# EasyEDA Pro project 工创赛底盘主控v3_2025-03-24.epro, board PCB1
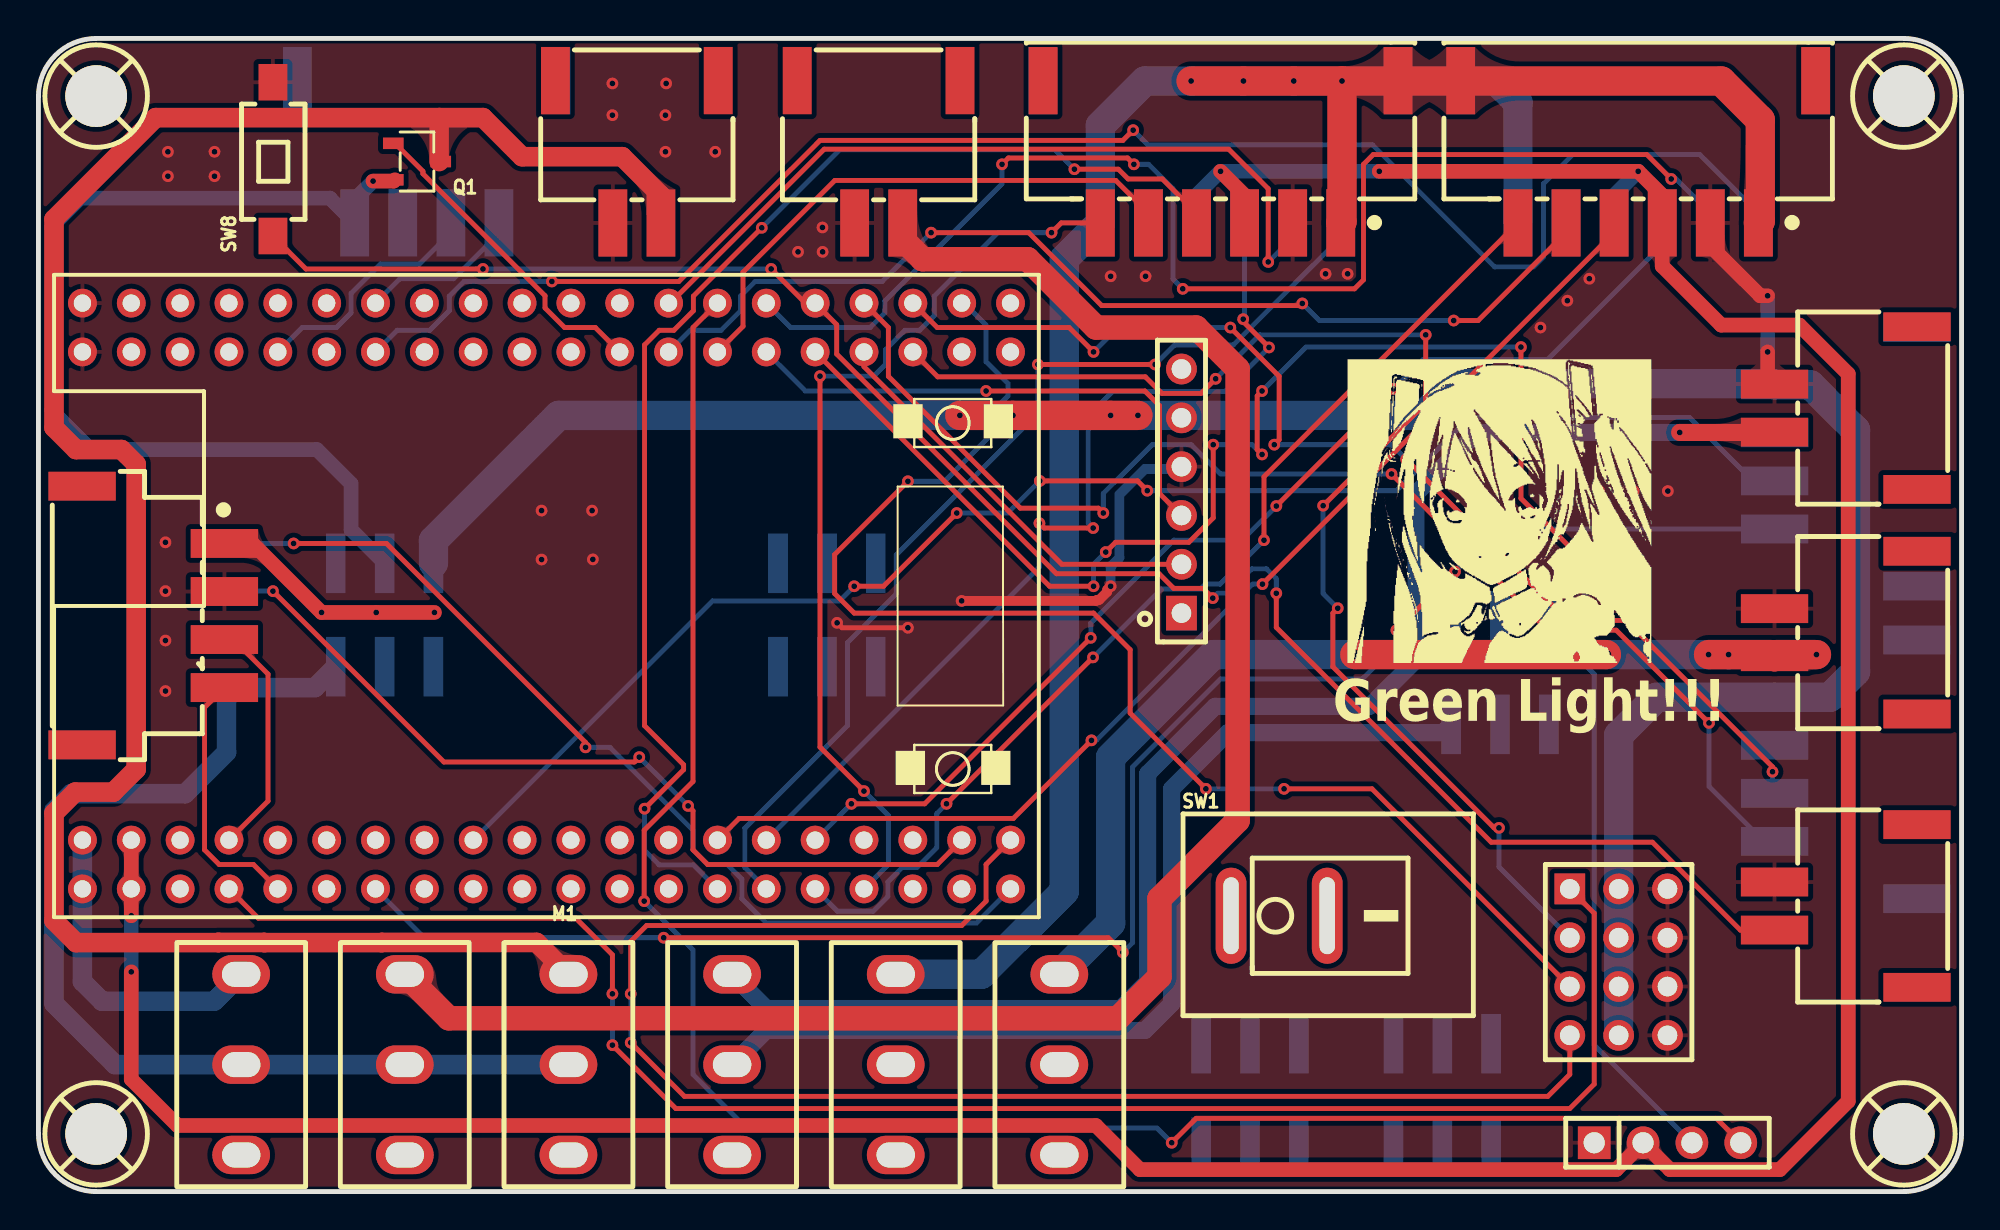
[diagram p7: board, top side]
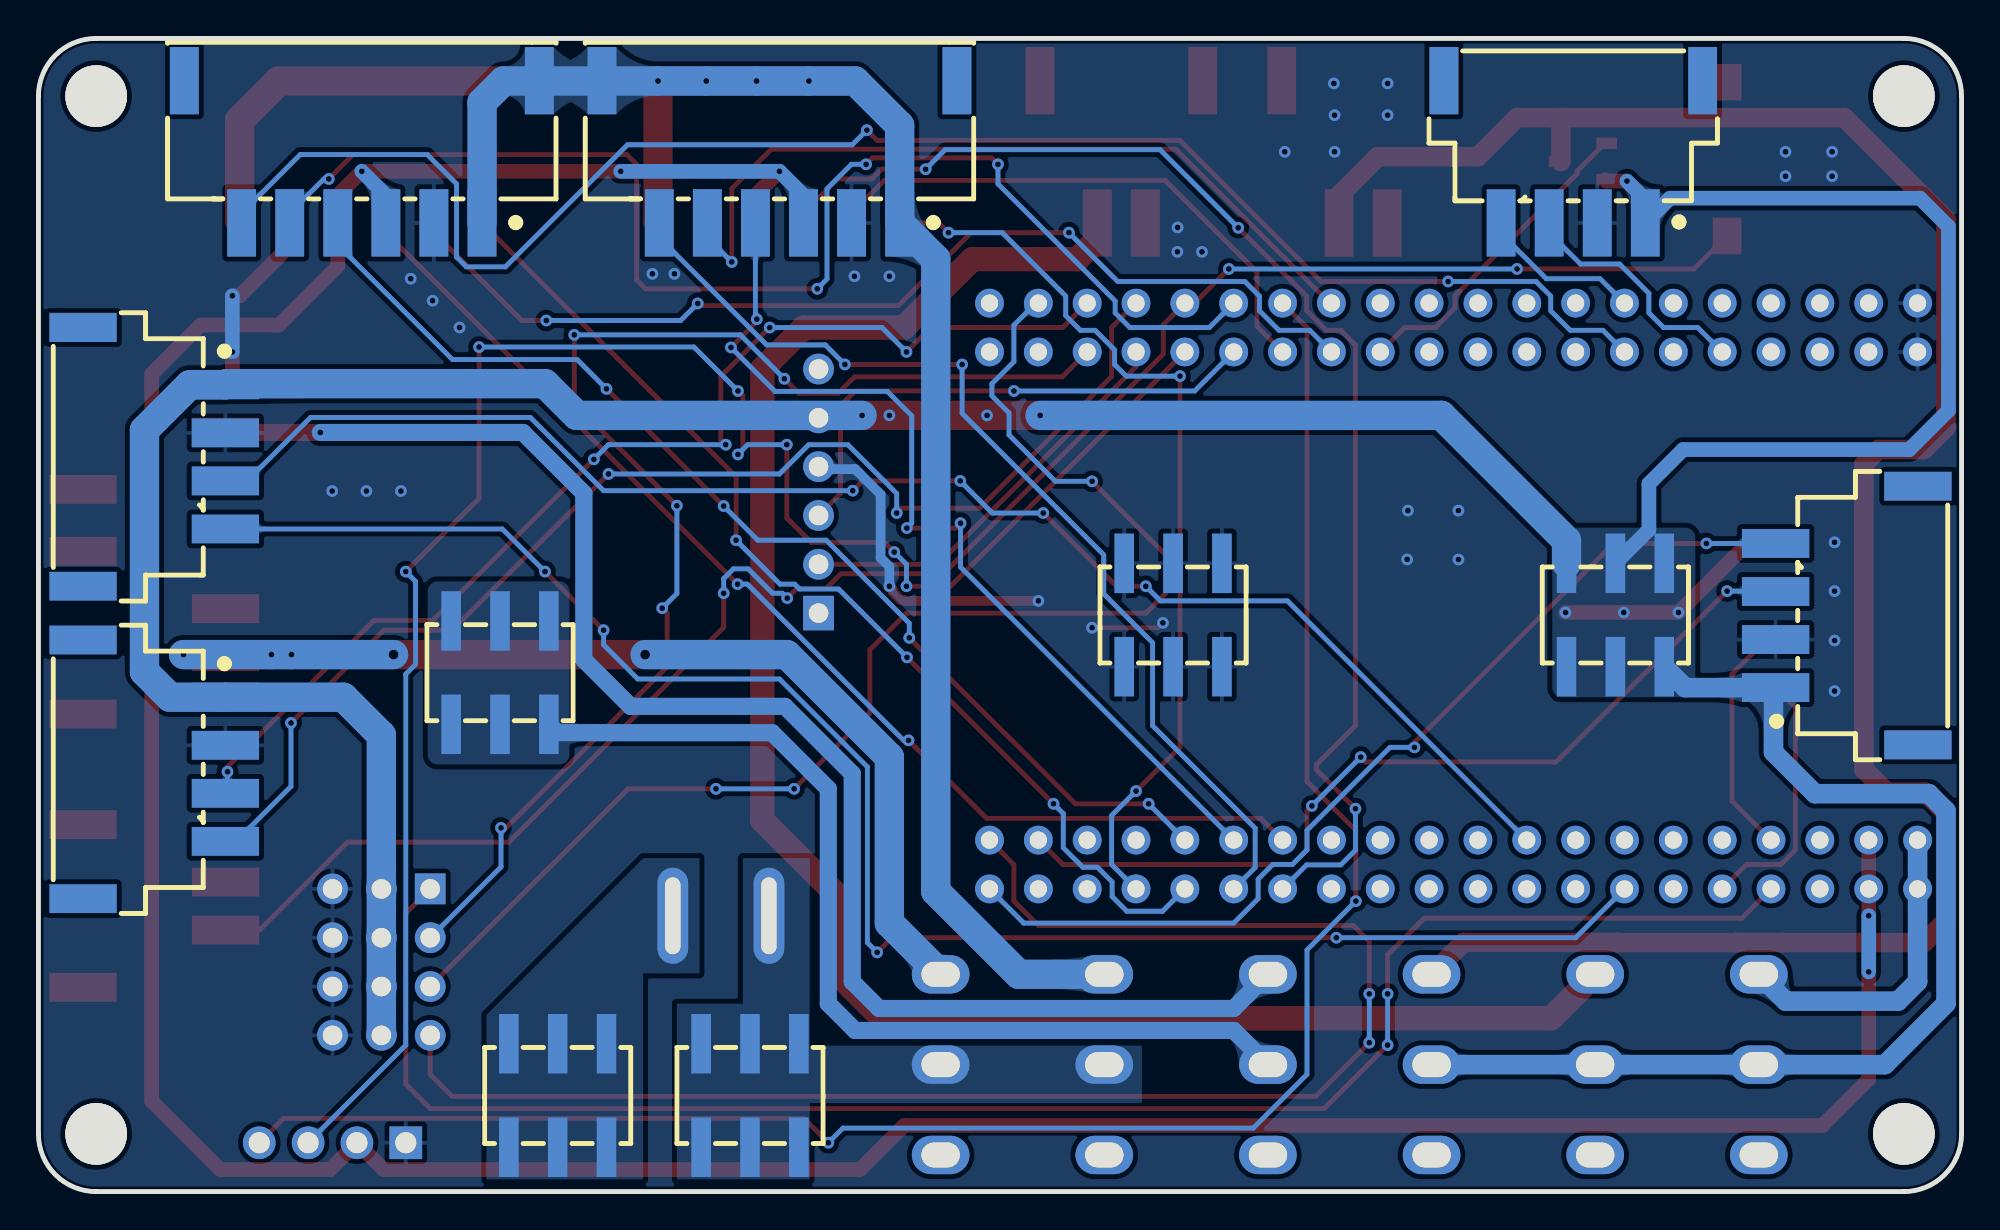
[diagram p8: board, bottom side, seen from below]

Outline 100 x 60 mm; copper layers: Top Layer, Bottom Layer. Coordinates in mm from the lower left corner of the outline.
Outline path: 0,57 0,3 arc(0,2.99) 0,2.97 arc(0.89,0.87) 3,0 97,0 arc(99.12,0.88) 100,3 100,57 arc(99.12,59.12) 97,60 3,60 arc(0.88,59.12) 0,57
Stack: Top Layer 0.035mm / Dielectric1 1.51mm FR4 er 4.5 / Bottom Layer 0.035mm

## Design rules (mm)
template: 自定义配置
spacing copperThickness1oz (default): track to track 0.203, other pairs 0.152 to 0.3
spacing copperThickness2oz: track to track 0.203, other pairs 0.152 to 0.3
track width copperThickness1oz (default): min 0.254, default 0.254, max 2.54
track width copperThickness2oz: min 0.203, default 0.254, max 2.54
differential pair differentialPair (default): width min 0.127, default 0.254, max 2.54; gap min 0.152, default 0.152
via viaSize (default): diameter min 0.5, default 0.61, max 10; hole min 0.3, default 0.305, max 6.299

## Placement (name value [footprint] x y rotation side)
CN1  WAFER-254W-6P  [CONN-SMD_WAFER-254W-6P]  61.47 54.1 180 top
CN2  WAFER-254W-6P  [CONN-SMD_WAFER-254W-6P]  83.19 54.1 180 top
CN3  WAFER-254W-6P  [CONN-SMD_WAFER-254W-6P]  61.47 54.1 0 bottom
CN4  WAFER-254W-6P  [CONN-SMD_WAFER-254W-6P]  83.19 54.1 0 bottom
CN6  WAFER-254W-2P  [CONN-SMD_2P-L10.0-W7.8-P2.5]  31.12 54.1 180 top
CN7  WAFER-254W-2P  [CONN-SMD_2P-L10.0-W7.8-P2.5]  93.98 40.77 90 top
CN8  WAFER-254W-2P  [CONN-SMD_2P-L10.0-W7.8-P2.5]  43.69 54.1 180 top
CN9  WAFER-254W-2P  [CONN-SMD_2P-L10.0-W7.8-P2.5]  93.98 29.08 90 top
CN10  WAFER-254W-2P  [CONN-SMD_2P-L10.0-W7.8-P2.5]  93.98 14.86 90 top
H2  PZ254-2-03-S  [HDR-SMD_6P-P2.54-V-M-R2-C3-LS7.5-2]  76 27 180 bottom
H3  PZ254-2-03-S  [HDR-SMD_6P-P2.54-V-M-R2-C3-LS7.5-2]  18 30 180 bottom
H4  PZ254-2-03-S  [HDR-SMD_6P-P2.54-V-M-R2-C3-LS7.5-2]  41 30 180 bottom
H5  PZ254-2-03-S  [HDR-SMD_6P-P2.54-V-M-R2-C3-LS7.5-2]  73 5 180 bottom
H6  PZ254-2-03-S  [HDR-SMD_6P-P2.54-V-M-R2-C3-LS7.5-2]  63 5 180 bottom
H7  2.54-1*4P母  [HDR-TH_4P-P2.54-V-F]  84.71 2.54 0 top
M1  -  [FK407M1]  2.29 18.29 180 top
Q1  AO3407  [SOT-23-3_L2.9-W1.6-P1.90-LS2.8-BR]  19.69 53.59 180 top
SCREW1  -  [M3螺丝]  3 57 0 top
SCREW2  -  [M3螺丝]  97 57 0 top
SCREW3  -  [M3螺丝]  3 3 0 top
SCREW4  -  [M3螺丝]  97 3 0 top
SW1  KCD11-2P-R  [SW-TH_2P-L15.0-W10.5-P5.00_KCD11-2P-R]  64.52 14.35 0 top
SW2  SS-12D10L5  [SW-TH_SS-12D10L5]  27.56 6.6 270 top
SW3  SS-12D10L5  [SW-TH_SS-12D10L5]  36.07 6.6 270 top
SW4  SS-12D10L5  [SW-TH_SS-12D10L5]  10.54 6.6 270 top
SW5  SS-12D10L5  [SW-TH_SS-12D10L5]  44.58 6.6 270 top
SW6  SS-12D10L5  [SW-TH_SS-12D10L5]  53.09 6.6 270 top
SW7  SS-12D10L5  [SW-TH_SS-12D10L5]  19.05 6.6 270 top
SW8  TS-1101-C-W  [SW-SMD_L6.0-W3.3-LS8.0]  12.19 53.72 90 top
U1  WAFER-254W-4P  [CONN-SMD_4P-P2.50-WAFER-254W-4P]  5.97 29.97 270 top
U4  KH-2.54PH180-3X4P-L11.5  [HDR-TH-12P-P2.54-V-M-R3-C4-S5.08]  82.17 11.94 270 top
U5  PM2.54-1*6  [HDR-TH_6P-P2.54-V-F]  59.44 36.45 90 top
U6  WAFER-254W-4P  [CONN-SMD_4P-P2.50-WAFER-254W-4P]  20.19 54.1 0 bottom
U7  WAFER-254W-4P  [CONN-SMD_4P-P2.50-WAFER-254W-4P]  93.98 21.97 270 bottom
U8  WAFER-254W-4P  [CONN-SMD_4P-P2.50-WAFER-254W-4P]  93.98 38.23 270 bottom
U9  WAFER-254W-4P  [CONN-SMD_4P-P2.50-WAFER-254W-4P]  5.97 29.97 90 bottom

## Footprints (pads in the part's own frame, mm; a bottom-side part is the same pattern mirrored in y, then rotated)
CONN-SMD_2P-L10.0-W7.8-P2.5
  rect 1.5x3.5 smd: 1(-1.253,3.704) 2(1.248,3.704) 3(4.232,-3.704) 4(-4.232,-3.704)
CONN-SMD_4P-P2.50-WAFER-254W-4P
  rect 1.5x3.5 smd: 1(-3.75,3.7) 2(-1.25,3.7) 3(1.25,3.7) 4(3.75,3.7) 5(-6.73,-3.7) 6(6.73,-3.7)
CONN-SMD_WAFER-254W-6P
  rect 1.5x3.5 smd: 1(-6.25,3.7) 2(-3.75,3.7) 3(-1.25,3.7) 4(1.25,3.7) 5(3.75,3.7) 6(6.25,3.7) 7(-9.23,-3.7) 8(9.23,-3.7)
FK407M1
  round 1.5 hole 0.9: 1(0,-25.4) 2(0,-27.94) 3(-2.54,-25.4) 4(-2.54,-27.94) 5(-5.08,-25.4) 6(-5.08,-27.94) 7(-7.62,-25.4) 8(-7.62,-27.94) 9(-10.16,-25.4) 10(-10.16,-27.94) 11(-12.7,-25.4) 12(-12.7,-27.94) 13(-15.24,-25.4) 14(-15.24,-27.94) 15(-17.78,-25.4) 16(-17.78,-27.94) 17(-20.32,-25.4) 18(-20.32,-27.94) 19(-22.86,-25.4) 20(-22.86,-27.94) 21(-25.4,-25.4) 22(-25.4,-27.94) 23(-27.94,-25.4) 24(-27.94,-27.94) 25(-30.48,-25.4) 26(-30.48,-27.94) 27(-33.02,-25.4) 28(-33.02,-27.94) 29(-35.56,-25.4) 30(-35.56,-27.94) 31(-38.1,-25.4) 32(-38.1,-27.94) 33(-40.64,-25.4) 34(-40.64,-27.94) 35(-43.18,-25.4) 36(-43.18,-27.94) 37(-45.72,-25.4) 38(-45.72,-27.94) 39(-48.26,-25.4) 40(-48.26,-27.94) 41(0,2.54) 42(0,0) 43(-2.54,2.54) 44(-2.54,0) 45(-5.08,2.54) 46(-5.08,0) 47(-7.62,2.54) 48(-7.62,0) 49(-10.16,2.54) 50(-10.16,0) 51(-12.7,2.54) 52(-12.7,0) 53(-15.24,2.54) 54(-15.24,0) 55(-17.78,2.54) 56(-17.78,0) 57(-20.32,2.54) 58(-20.32,0) 59(-22.86,2.54) 60(-22.86,0) 61(-25.4,2.54) 62(-25.4,0) 63(-27.94,2.54) 64(-27.94,0) 65(-30.48,2.54) 66(-30.48,0) 67(-33.02,2.54) 68(-33.02,0) 69(-35.56,2.54) 70(-35.56,0) 71(-38.1,2.54) 72(-38.1,0) 73(-40.64,2.54) 74(-40.64,0) 75(-43.18,2.54) 76(-43.18,0) 77(-45.72,2.54) 78(-45.72,0) 79(-48.26,2.54) 80(-48.26,0)
HDR-SMD_6P-P2.54-V-M-R2-C3-LS7.5-2
  rect 1.02x3.1 smd: 1(-2.54,-2.69) 2(-2.54,2.69) 3(0,-2.69) 4(0,2.69) 5(2.54,-2.69) 6(2.54,2.69)
HDR-TH-12P-P2.54-V-M-R3-C4-S5.08
  rect 1.6x1.6 hole 1.02: 1(-3.81,-2.54)
  round 1.6 hole 1.02: 2(-3.81,0) 3(-3.81,2.54) 4(-1.27,-2.54) 5(-1.27,0) 6(-1.27,2.54) 7(1.27,-2.54) 8(1.27,0) 9(1.27,2.54) 10(3.81,-2.54) 11(3.81,0) 12(3.81,2.54)
HDR-TH_4P-P2.54-V-F
  rect 1.7x1.7 hole 1.1: 1(-3.81,0)
  round 1.7 hole 1.1: 2(-1.27,0) 3(1.27,0) 4(3.81,0)
HDR-TH_6P-P2.54-V-F
  rect 1.8x1.6 hole 1.02: 1(-6.35,0)
  round 1.6 hole 1.02: 2(-3.81,0) 3(-1.27,0) 4(1.27,0) 5(3.81,0) 6(6.35,0)
M3螺丝
  round 3.2 hole 3.2: 1(0,0)
SOT-23-3_L2.9-W1.6-P1.90-LS2.8-BR
  rect 1.07x0.6 smd: 1(1.235,-0.95) 2(1.235,0.95) 3(-1.235,0)
SW-SMD_L6.0-W3.3-LS8.0
  rect 1.9x1.5 smd: 1(-4,0) 2(4,0)
SW-TH_2P-L15.0-W10.5-P5.00_KCD11-2P-R
  oval 1.6x5 hole 0.8x4: 1(-2.5,0) 2(2.5,0)
SW-TH_SS-12D10L5
  oval 2x3 hole 1.3x2: 1(-4.7,0) 2(0,0) 3(4.7,0)

## Nets
As in the schematic.

Pads without a net: CN1 8; CN2 7; CN3 7; CN4 8; CN6 3 4; CN7 3 4; CN8 3 4; CN9 3 4; CN10 3 4; M1 3 4 5 6 7 8 10 11 12 15 16 17 18 19 20 22 24 37 39 40 45 46 50 51 52 54 55 56 61 62 65 66 74 75 76 77; SCREW1 1; SCREW2 1; SCREW3 1; SCREW4 1; SW2 3; SW3 3; SW4 3; SW5 3; SW6 3; SW7 3; U1 5 6; U5 1 6; U6 5 6; U7 5 6; U8 5 6; U9 5 6

## Via types
v1: diameter 0.61, hole 0.305, Top Layer to Bottom Layer, 136 vias
v2: diameter 0.762, hole 0.508, Top Layer to Bottom Layer, 2 vias

## Routing (per net, layer and track width the routed paths; a pad name or vN(x,y) marks a point on that pad's centre or on a via; arc(x,y) is an arc through that point)
3.3V: length 192.9
  Top Layer w0.762: v1(69.72,53.09) v1(83.19,53.09) 84.44,51.84 CN2.3 84.44,48.15 87.5,45.08 91.57,45.08 94.11,42.55 94.11,4.7 90.55,1.14 84.84,1.14 H7.2 82.04,1.14 57.28,1.14 54.98,3.44 7.23,3.44 4.83,5.84 v1(4.83,11.43) ; CN1.3 62.72,51.84 v1(61.47,53.09) ; M1.44 M1.43 v1(4.83,14.35)
  Bottom Layer w0.762: CN3.3 60.22,51.84 v1(61.47,53.09) v1(69.72,53.09) ; CN4.3 81.94,51.84 v1(83.19,53.09) ; v1(4.83,14.35) v1(4.83,11.43)
+24V_RO: length 57
  Top Layer w1.524: v1(86.84,27.94) v1(87.89,27.94) 90.17,27.94 CN9.1 90.39,27.94 v1(92.46,27.94) ; v2(68.45,27.94) v2(81.53,27.94)
  Bottom Layer w1.524: v2(81.53,27.94) v1(86.84,27.94) v1(87.89,27.94) v1(92.46,27.94) ; v2(68.45,27.94) 61.09,27.94 55.75,22.61 55.75,13.97 SW6.1
+24V_WH: length 123.8
  Top Layer w1.524: v1(59.94,57.78) v1(62.66,57.78) v1(65.28,57.78) v1(67.78,57.78) ; CN2.1 89.54,50.5 89.54,55.75 87.5,57.78 v1(67.78,57.78) ; CN1.1 67.78,50.47 v1(67.78,57.78)
  Bottom Layer w1.524: SW5.1 49.02,11.3 53.34,15.62 53.34,48.52 CN3.1 55.22,55.47 57.53,57.78 v1(59.94,57.78) v1(62.66,57.78) v1(65.28,57.78) v1(67.78,57.78) 75.82,57.78 76.94,56.67 CN4.1
GND: length 30.7
  Top Layer w0.254: v1(45.21,29.34) 41.78,29.34 v1(41.53,29.59)
  Top Layer w0.508: v1(55.75,31.5) 55.58,31.32 55.58,31.2 55.16,30.78 55.04,30.78 54.99,30.73 v1(48.01,30.73)
  Top Layer w0.762: CN2.2 86.94,49.21 89.54,46.61 v1(89.92,46.61) ; CN7.2 89.92,42.37 v1(89.92,43.69)
  Bottom Layer w0.508: U5.4 59.31,37.59 57.53,37.59 56.21,36.27 56.21,32.98 55.75,32.52 v1(55.75,31.5)
  Bottom Layer w0.762: v1(89.92,43.69) v1(89.92,46.61)
  vias: v1(6.6,33.78) v1(6.6,31.24) v1(6.6,28.67) v1(6.6,26.04) v1(6.73,54.1) v1(6.73,52.83) v1(9.15,54.1) v1(9.15,52.83) v1(26.16,35.43) v1(26.16,32.89) v1(28.79,35.43) v1(28.83,32.89) v1(29.85,57.66) v1(29.85,56.01) v1(32.64,57.66) v1(32.6,56.01) v1(32.6,54.1) v1(35.19,54.1) v1(39.5,48.89) v1(40.77,50.17) v1(40.78,48.89) v1(55.75,47.62) v1(57.57,47.62) v1(66.93,47.75) v1(68.08,47.75) v1(78.11,44.96) v1(79.5,46.36) v1(80.65,47.5) v1(81.15,36.45) v1(82.95,36.45) v1(84.73,36.45)
VDD_5.0V: length 244
  Top Layer w0.762: v1(17.4,52.58) 18.47,52.58 18.54,52.64 ; v1(20.59,30.13) v1(17.56,30.13) v1(14.72,30.13) 11.13,33.72 U1.1
  Top Layer w1.524: v1(47.91,40.39) v1(50.67,40.39) v1(55.75,40.39) v1(57.17,40.39)
  Bottom Layer w0.762: v1(17.4,52.58) 16.44,51.62 U6.1 15.16,51.69 2.16,51.69 0.68,50.21 0.68,40.64 2.71,38.61 14.48,38.61 16.26,36.83 16.26,34.43 H3.4
  Bottom Layer w1.016: H3.5 14.37,26.22 U9.1 9.78,26.11 9.78,22.86 7.62,20.7 1.7,20.7 0.81,19.81 0.81,9.78 3.98,6.6 SW4.2 SW7.2 SW2.2
  Bottom Layer w1.524: v1(57.17,40.39) 72.01,40.39 73.66,42.04 90.22,42.04 U8.1 92.14,41.98 94.49,39.62 94.49,27.05 93.16,25.72 U7.1 84.14,25.72 82.17,23.75 U4.2 U4.5 U4.8 U4.11 ; H3.2 20.54,33.88 27.05,40.39 v1(47.91,40.39)
VDD_5.0V_IN: length 16.6
  Bottom Layer w1.016: M1.42 M1.41 2.29,10.92 3.3,9.91 9.14,9.91 SW4.1
VDD_19.0V: length 51.3
  Bottom Layer w0.889: H2.5 73.03,23.88 61.85,23.88 58.93,20.95 58.93,9.78 57.53,8.38 37.85,8.38 SW3.2
PA0_U4_TX: length 65.9
  Top Layer w0.254: v1(86.87,24.38) 82.04,29.21 78.49,29.21 v1(70.36,37.34) ; v1(55.37,35.31) 55.12,35.56 51.05,35.56 44.2,42.42 44.2,44.96 M1.34
  Bottom Layer w0.254: U7.4 89.73,18.22 86.87,21.08 v1(86.87,24.38) ; v1(55.37,35.31) 55.37,36.32 57.91,38.86 59.94,38.86 61.47,37.34 v1(70.36,37.34)
PA1_U4_RX: length 59.6
  Top Layer w0.254: v1(71.12,38.1) 79.5,29.72 82.55,29.72 90.17,22.1 v1(90.17,21.84) ; M1.36 46.74,44.96 53.59,44.96 v1(54.86,43.69) ; v1(64.26,38.86) 64.52,39.12 64.52,42.42 v1(61.98,44.96)
  Bottom Layer w0.254: v1(54.86,43.69) 56.13,44.96 v1(61.98,44.96) ; v1(71.12,38.1) 70.36,38.86 v1(64.26,38.86) ; U7.3 90.17,20.83 v1(90.17,21.84)
PA2_U2_TX: length 21.5
  Top Layer w0.254: U5.2 53.21,32.64 42.93,42.93 M1.33
PA3_U2_RX: length 27.8
  Top Layer w0.254: U5.3 58.29,36.32 58.29,40.89 57.53,41.66 v1(49.28,41.66)
  Bottom Layer w0.254: M1.29 39.88,41.66 v1(49.28,41.66)
PA4: length 96.7
  Top Layer w0.254: v1(23.11,48.01) 13.91,48.01 SW8.1 ; CN10.1 88.5,13.61 83.93,18.18 75.54,18.18 64.37,29.35 v1(64.37,31.13) ; v1(38.1,48.01) 39.88,46.23 M1.32 41.51,45.11 41.51,43.58 52.94,32.15 58.27,32.15 59.03,31.39 60.56,31.39 v1(61.07,30.88)
  Bottom Layer w0.254: v1(64.37,31.13) 64.37,31.89 63.86,32.4 63.1,32.4 61.83,31.13 61.32,31.13 v1(61.07,30.88) ; v1(38.1,48.01) v1(23.11,48.01)
PA5: length 68
  Top Layer w0.254: v1(50.11,53.45) 50.44,53.78 56.63,53.78 v1(56.96,53.45) ; v1(59.5,46.97) 68.44,46.97 68.9,47.44 68.9,53.45 69.41,53.96 83.63,53.96 v1(84.9,52.69)
  Bottom Layer w0.254: v1(84.9,52.69) 85.16,52.69 86.94,50.91 CN4.5 ; v1(50.11,53.45) 50.11,52.43 44.01,46.34 44.01,45.72 43.25,44.96 39.12,44.96 M1.30 ; v1(59.5,46.97) 59,47.48 59,52.18 57.73,53.45 v1(56.96,53.45)
PA6: length 29
  Top Layer w0.254: M1.27 36.64,45.02 36.64,47.84 41.41,52.61 56.02,52.61 57.72,50.91 CN1.5
PA7: length 54.1
  Top Layer w0.254: v1(73.59,45.32) 74.86,45.32 79.44,49.89 CN2.5 ; v1(65.72,46.21) 65.61,46.1 55.29,46.1 51.5,49.89 v1(46.42,49.89)
  Bottom Layer w0.254: v1(46.42,49.89) 43.88,47.35 37.27,47.35 36.51,46.59 36.51,45.83 35.49,44.81 33.89,44.81 M1.25 ; v1(65.72,46.21) 66.61,45.32 v1(73.59,45.32)
PA9_U1_TX: length 13.5
  Top Layer w0.254: U1.4 8.64,25.19 8.64,17.78 9.4,17.02 11.18,17.02 M1.49
PA10_U1_RX: length 12.5
  Top Layer w0.254: U1.3 10.14,28.72 11.94,26.92 11.94,20.32 M1.48
PB0: length 41.7
  Top Layer w0.254: v1(63.95,48.37) 63.95,52.18 61.89,54.24 40.86,54.24 32.85,46.23 M1.26
  Bottom Layer w0.254: v1(63.95,48.37) 65.22,49.64 CN3.5
PB10_U3_TX: length 8.5
  Bottom Layer w0.254: M1.14 18.8,47.5 21.59,47.5 23.94,49.85 U6.4
PB11_U3_RX: length 12.7
  Bottom Layer w0.254: M1.9 13.72,44.96 15.49,44.96 16.26,45.72 16.26,46.74 17.78,48.26 19.81,48.26 21.44,49.89 U6.3
PC3: length 97.9
  Top Layer w0.254: v1(63.63,41.66) 63.37,41.4 63.37,38.61 v1(63.63,38.35) ; v1(77.09,43.94) 77.09,36.07 v1(80.9,32.26) ; M1.31 52.58,31.5 v1(54.86,31.5) ; v1(61.09,38.86) 61.09,35.05 59.82,33.78 56.01,33.78 v1(55.5,33.27)
  Bottom Layer w0.254: v1(55.5,33.27) 54.86,32.64 v1(54.86,31.5) ; v1(77.09,43.94) 65.91,43.94 v1(63.63,41.66) ; v1(61.09,38.86) 63.12,38.86 v1(63.63,38.35) ; H7.3 80.9,7.62 80.9,26.92 80.39,27.43 80.39,31.75 v1(80.9,32.26)
PC4: length 99.8
  Top Layer w0.254: H7.4 87.25,3.81 60.2,3.81 v1(58.93,2.54) ; M1.28 34.04,44.96 34.04,21.34 31.5,18.8 v1(31.5,15.11)
  Bottom Layer w0.254: v1(31.5,15.11) 34.04,12.57 34.04,6.1 36.83,3.3 58.17,3.3 v1(58.93,2.54)
PC5: length 16.6
  Top Layer w0.254: M1.23 28.96,44.96 27.36,44.96 26.34,45.97 26.34,46.61 19.99,52.96 19.99,53.09 18.54,54.54
PC6_U6_TX: length 51.1
  Top Layer w0.254: v1(13.27,33.72) 18.09,33.72 28.45,23.37 v1(28.45,23.11)
  Bottom Layer w0.254: v1(28.45,23.11) 29.72,23.11 34.04,18.8 34.04,17.78 34.8,17.02 35.81,17.02 36.58,16.26 36.58,15.24 37.85,13.97 48.77,13.97 M1.79 ; v1(13.27,33.72) U9.4
PC7_U6_RX: length 46.2
  Top Layer w0.254: v1(33.78,20.07) 34.04,19.81 34.04,17.78 34.8,17.02 46.74,17.02 M1.78 ; v1(31.24,22.61) 30.99,22.35 21.08,22.35 v1(12.19,31.24)
  Bottom Layer w0.254: U9.3 9.69,31.24 v1(12.19,31.24) ; v1(33.78,20.07) v1(31.24,22.61)
PC12_U5_TX: length 89.1
  Top Layer w0.254: v1(70.61,29.21) v1(73.66,32.26) ; v1(56.39,12.45) 55.63,13.21 v1(32.51,13.21)
  Bottom Layer w0.254: v1(56.39,12.45) 56.9,12.95 56.9,22.1 61.47,26.67 68.83,26.67 70.61,28.45 v1(70.61,29.21) ; U8.4 75.88,34.48 v1(73.66,32.26) ; M1.53 20.07,13.21 v1(32.51,13.21)
PD2_U5_RX: length 78.6
  Top Layer w0.254: v1(42.42,31.5) 43.94,31.5 v1(47.75,35.31) ; v1(57.66,36.47) 57.15,36.98 v1(52.07,36.98)
  Bottom Layer w0.254: U8.3 89.15,36.98 85.85,40.28 74.42,40.28 70.61,36.47 v1(57.66,36.47) ; M1.58 35.05,30.73 41.66,30.73 v1(42.42,31.5) ; v1(52.07,36.98) 50.4,35.31 v1(47.75,35.31)
PD12: length 89.7
  Top Layer w0.254: v1(29.85,7.62) 33.15,4.32 79.63,4.32 80.9,5.59 80.9,14.48 79.63,15.75 ; M1.47 11.43,14.22 27.94,14.22 29.85,12.32 v1(29.85,10.29)
  Bottom Layer w0.254: v1(29.85,10.29) v1(29.85,7.62)
PD13: length 68.1
  Top Layer w0.254: v1(67.56,30.35) 67.31,30.1 67.31,27.31 75.69,18.92 v1(75.95,18.92) ; v1(72.14,44.58) 72.14,41.02 v1(66.8,35.69) ; v1(61.21,42.29) 60.45,41.53 58.42,41.53 57.56,42.39 46.76,42.39 M1.35
  Bottom Layer w0.254: v1(72.14,44.58) 63.5,44.58 v1(61.21,42.29) ; 79.63,13.21 75.95,16.89 v1(75.95,18.92) ; v1(67.56,30.35) 66.8,31.11 v1(66.8,35.69)
PD14: length 69.7
  Top Layer w0.254: v1(45.21,36.96) 41.4,33.15 41.4,31.11 42.42,30.1 54.86,30.1 56.77,28.19 56.77,24.89 v1(60.71,20.95) ; v1(64.77,20.95) 69.34,20.95 79.63,10.67
  Bottom Layer w0.254: v1(45.21,36.96) 47.12,36.96 49.53,39.37 49.53,40.51 50.42,41.4 50.42,42.04 49.28,43.18 49.28,45.08 48.13,46.23 M1.38 ; v1(64.77,20.95) v1(60.71,20.95)
PD15: length 80.8
  Top Layer w0.254: 79.63,8.13 79.63,6.1 78.49,4.95 33.59,4.95 v1(30.8,7.75) ; v1(30.8,10.29) 30.8,13.02 31.62,13.84 48.01,13.84 49.28,15.11 49.28,17.02 M1.80
  Bottom Layer w0.254: v1(30.8,10.29) v1(30.8,7.75)
PE0: length 67.8
  Top Layer w0.254: v1(53.87,53.2) 56.15,53.2 56.66,52.69 58.44,52.69 60.22,50.91 CN1.4 ; v1(31.52,19.92) 33.55,21.95 33.55,22.21 31.52,24.24 31.52,44.05 32.28,44.81 33.04,44.81 34.06,45.83 34.06,46.59 v1(37.61,50.15)
  Bottom Layer w0.254: M1.67 34.06,17 32.28,17 31.52,17.76 v1(31.52,19.92) ; v1(37.61,50.15) 41.68,54.21 52.85,54.21 v1(53.87,53.2)
PE1: length 60.2
  Top Layer w0.254: v1(63.65,31.61) 81.94,49.89 CN2.4 ; M1.68 36.43,19.41 50.69,19.41 v1(54.76,23.48)
  Bottom Layer w0.254: v1(63.65,31.61) 63.14,31.61 55.01,23.48 v1(54.76,23.48)
PE2: length 49.2
  Top Layer w0.254: v1(62.65,45.39) 62.65,45.26 v1(63.99,43.92) ; v1(54.84,34.52) 52.3,34.52 v1(52.05,34.78)
  Bottom Layer w0.254: CN3.4 62.72,45.47 v1(62.65,45.39) ; v1(54.84,34.52) 54.59,34.78 54.59,40.37 55.86,41.64 61.7,41.64 v1(63.99,43.92) ; M1.70 52.05,32.49 v1(52.05,34.78)
PE3: length 58.5
  Top Layer w0.254: v1(70.47,41.77) v1(64.37,35.67) ; v1(54.72,28.81) 46.08,20.18 v1(42.27,20.18)
  Bottom Layer w0.254: CN4.4 84.44,49.26 78.47,43.29 71.99,43.29 v1(70.47,41.77) ; v1(64.37,35.67) 62.59,33.89 59.04,33.89 54.72,29.57 v1(54.72,28.81) ; v1(42.27,20.18) M1.72
PE4: length 47.6
  Top Layer w0.254: CN1.6 53.19,50.4 v1(52.68,49.89) ; v1(40.64,42.43) 40.64,23.12 v1(42.93,20.84)
  Bottom Layer w0.254: v1(42.93,20.84) 44.2,19.57 44.2,17.02 M1.73 ; v1(40.64,42.43) 43.43,42.43 44.04,43.04 44.04,43.8 45.06,44.81 45.82,44.81 46.58,45.58 46.58,46.59 49.88,49.89 v1(52.68,49.89)
PE5: length 55.3
  Top Layer w0.254: v1(63.73,33.89) 63.73,37.19 CN2.6 ; v1(54.84,27.8) v1(47.22,20.18)
  Bottom Layer w0.254: v1(63.73,33.89) 61.44,31.61 60.68,31.61 60.43,31.35 58.39,31.35 v1(54.84,27.8) ; M1.71 41.55,14.59 43.41,14.59 44.17,15.35 44.17,16.11 44.93,16.87 45.69,16.87 46.71,17.89 46.71,19.67 v1(47.22,20.18)
PE6: length 53.3
  Top Layer w0.254: v1(58.07,43.04) v1(51.97,43.04)
  Bottom Layer w0.254: v1(51.97,43.04) 51.97,40.5 44.6,33.13 44.6,31.1 42.06,28.56 42.06,24.24 36.73,18.91 36.73,16.86 M1.69 ; v1(58.07,43.04) 59.08,44.05 62.13,44.05 67.72,49.64 CN3.6
PE7: length 86.5
  Top Layer w0.254: v1(56.92,55.23) 56.39,54.69 40.64,54.69 33.3,47.35 v1(26.7,47.35)
  Bottom Layer w0.254: M1.13 18.65,44.81 20.35,44.81 21.36,45.83 21.36,46.59 22.13,47.35 v1(26.7,47.35) ; v1(56.92,55.23) 57.69,54.47 69.37,54.47 75.72,48.12 77.75,48.12 78.26,48.62 78.26,52.43 79.78,53.96 86.39,53.96 89.44,50.91 CN4.6
$1N1643: length 109.7
  Top Layer w1.016: CN6.1 32.37,51.83 30.35,53.85 25.15,53.85 23.11,55.88 20.85,55.88 ; 20.85,55.88 6.1,55.88 0.81,50.59 0.81,39.75 1.95,38.61 4.32,38.61 5.08,37.85 5.08,21.97 3.89,20.78 1.91,20.78 0.81,19.69 0.81,14.1 1.95,12.95 9.34,12.95 9.35,12.96 11.73,12.96 11.74,12.95 17.85,12.95 17.86,12.96 25.9,12.96 SW2.1 ; 20.85,55.88 20.84,55.87 20.84,53.59
$1N3078: length 78.8
  Top Layer w0.889: v1(85.34,39.5) 90.26,39.5 CN7.1
  Bottom Layer w0.889: SW3.1 37.85,9.53 56.29,9.53 57.68,10.92 57.68,21.75 61.18,25.25 69.22,25.25 71.64,27.67 71.64,36.33 74.8,39.5 v1(85.34,39.5)
$1N3176: length 95.5
  Top Layer w1.27: SW7.1 21.34,9.02 56.13,9.02 58.29,11.18 58.29,15.24 62.36,19.3 62.36,42.8 60.2,44.96 54.99,44.96 51.44,48.51 45.97,48.51 44.94,49.55 CN8.1

## Copper pours and planes (outline as drawn; the poured copper is in the pictures)
+24V on Bottom Layer: 59.9,17.35 66.8,17.35 66.8,0.63 59.9,0.63
+24V on Bottom Layer: 42.62,7.59 60.58,7.59 60.58,4.61 42.62,4.61
GND on Top Layer: -2.79,62.61 102.74,62.61 102.74,-3.56 -2.79,-3.56
GND on Bottom Layer: -2.41,62.61 102.87,62.61 102.87,-3.3 -2.41,-3.3
VDD_5.0V on Bottom Layer: 13.84,34.54 21.28,34.54 21.28,25.72 13.84,25.72
VDD_19.0V on Bottom Layer: 72.39,31.75 79.76,31.75 79.76,22.22 72.39,22.22
P_SW_IN on Bottom Layer: 65.63,17.35 76.71,17.35 76.71,0.63 65.63,0.63

Small or netless copper shapes (teardrops, artwork), in the pictures only: 119 on Top Layer, 140 on Bottom Layer

## Text on the board
Top Silkscreen Layer: Green Light!!!
